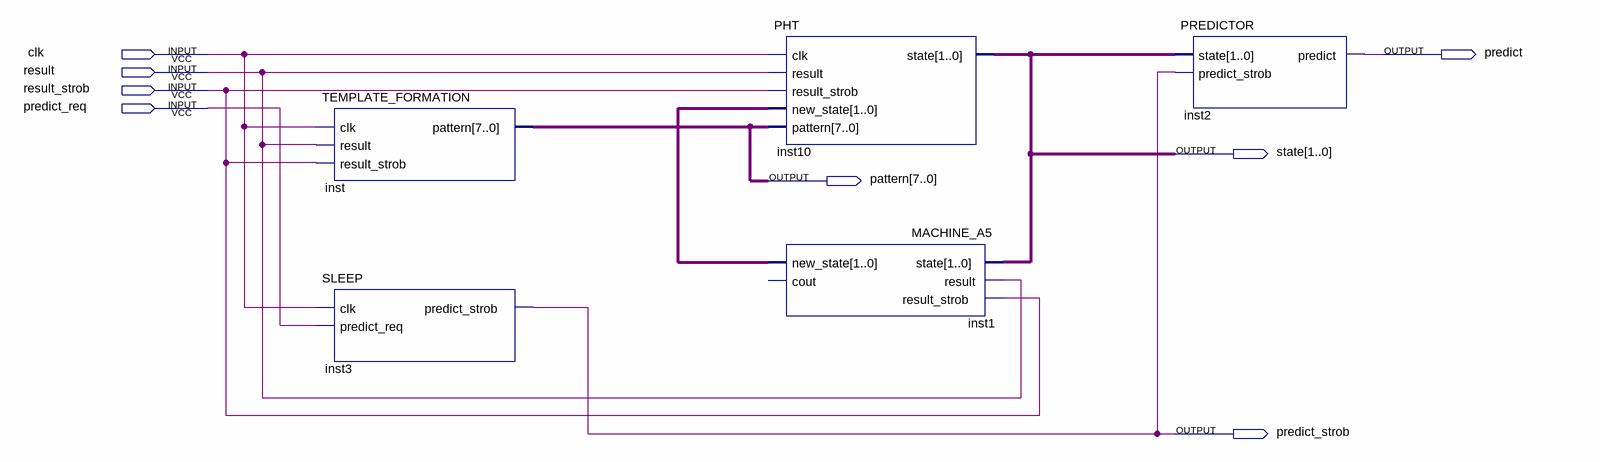
[diagram p0: schematic sheet]
// Quartus schematic MAIN.bdf as structural Verilog: 5 symbols, 8 pins
module MAIN (
  input  clk,
  input  result,
  input  result_strob,
  input  predict_req,
  output predict,
  output [1:0] state,
  output [7:0] pattern,
  output predict_strob
);

  wire [1:0] inst1_new_state;

  TEMPLATE_FORMATION inst (.clk(clk), .result(result), .result_strob(result_strob), .pattern(pattern));
  SLEEP inst3 (.clk(clk), .predict_req(predict_req), .predict_strob(predict_strob));
  PHT inst10 (
    .clk(clk), .result(result), .result_strob(result_strob), .new_state(inst1_new_state), .pattern(pattern),
    .state(state));
  MACHINE_A5 inst1 (
    .state(state), .result(result), .result_strob(result_strob), .new_state(inst1_new_state));  // open: cout
  PREDICTOR inst2 (.state(state), .predict_strob(predict_strob), .predict(predict));
endmodule
